# EAGLE design serieAX12 (EAGLE 6.3)
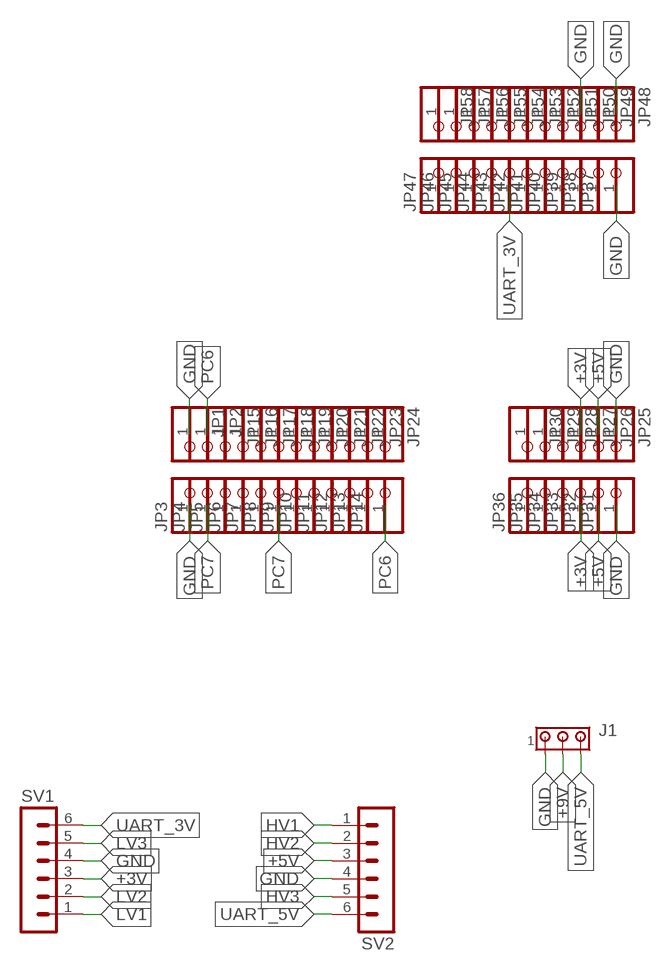
[diagram p0: schematic, sheet 1]

## Parts
J1  MTA03-100  [10X03MTA]
JP1  PINHD-1X1  [1X01]
JP2  PINHD-1X1  [1X01]
JP3  PINHD-1X1  [1X01]
JP4  PINHD-1X1  [1X01]
JP5  PINHD-1X1  [1X01]
JP6  PINHD-1X1  [1X01]
JP7  PINHD-1X1  [1X01]
JP8  PINHD-1X1  [1X01]
JP9  PINHD-1X1  [1X01]
JP10  PINHD-1X1  [1X01]
JP11  PINHD-1X1  [1X01]
JP12  PINHD-1X1  [1X01]
JP13  PINHD-1X1  [1X01]
JP14  PINHD-1X1  [1X01]
JP15  PINHD-1X1  [1X01]
JP16  PINHD-1X1  [1X01]
JP17  PINHD-1X1  [1X01]
JP18  PINHD-1X1  [1X01]
JP19  PINHD-1X1  [1X01]
JP20  PINHD-1X1  [1X01]
JP21  PINHD-1X1  [1X01]
JP22  PINHD-1X1  [1X01]
JP23  PINHD-1X1  [1X01]
JP24  PINHD-1X1  [1X01]
JP25  PINHD-1X1  [1X01]
JP26  PINHD-1X1  [1X01]
JP27  PINHD-1X1  [1X01]
JP28  PINHD-1X1  [1X01]
JP29  PINHD-1X1  [1X01]
JP30  PINHD-1X1  [1X01]
JP31  PINHD-1X1  [1X01]
JP32  PINHD-1X1  [1X01]
JP33  PINHD-1X1  [1X01]
JP34  PINHD-1X1  [1X01]
JP35  PINHD-1X1  [1X01]
JP36  PINHD-1X1  [1X01]
JP37  PINHD-1X1  [1X01]
JP38  PINHD-1X1  [1X01]
JP39  PINHD-1X1  [1X01]
JP40  PINHD-1X1  [1X01]
JP41  PINHD-1X1  [1X01]
JP42  PINHD-1X1  [1X01]
JP43  PINHD-1X1  [1X01]
JP44  PINHD-1X1  [1X01]
JP45  PINHD-1X1  [1X01]
JP46  PINHD-1X1  [1X01]
JP47  PINHD-1X1  [1X01]
JP48  PINHD-1X1  [1X01]
JP49  PINHD-1X1  [1X01]
JP50  PINHD-1X1  [1X01]
JP51  PINHD-1X1  [1X01]
JP52  PINHD-1X1  [1X01]
JP53  PINHD-1X1  [1X01]
JP54  PINHD-1X1  [1X01]
JP55  PINHD-1X1  [1X01]
JP56  PINHD-1X1  [1X01]
JP57  PINHD-1X1  [1X01]
JP58  PINHD-1X1  [1X01]
SV1  MA06-1  [MA06-1]
SV2  MA06-1  [MA06-1]

## Nets
+3V: JP27.1 JP33.1 SV1.3
+5V: JP26.1 JP32.1 SV2.3
+9V: J1.2
GND: J1.1 JP1.1 JP3.1 JP25.1 JP31.1 JP37.1 JP48.1 JP50.1 SV1.4 SV2.4
HV1: SV2.1
HV2: SV2.2
HV3: SV2.5
LV1: SV1.1
LV2: SV1.2
LV3: SV1.5
PC6: JP2.1 JP14.1
PC7: JP4.1 JP8.1
UART_3V: JP43.1 SV1.6
UART_5V: J1.3 SV2.6
Unconnected: JP5.1 JP6.1 JP7.1 JP9.1 JP10.1 JP11.1 JP12.1 JP13.1 JP15.1 JP16.1 JP17.1 JP18.1 JP19.1 JP20.1 JP21.1 JP22.1 JP23.1 JP24.1 JP28.1 JP29.1 JP30.1 JP34.1 JP35.1 JP36.1 JP38.1 JP39.1 JP40.1 JP41.1 JP42.1 JP44.1 JP45.1 JP46.1 JP47.1 JP49.1 JP51.1 JP52.1 JP53.1 JP54.1 JP55.1 JP56.1 JP57.1 JP58.1

## Library data of the parts
J1 = con-amp:MTA03-100: AMP connector
JP1-JP58 = pinhead:PINHD-1X1: PIN HEADER
SV1 SV2 = con-lstb:MA06-1: PIN HEADER; OC_FARNELL: unknown; OC_NEWARK: unknown

## Board
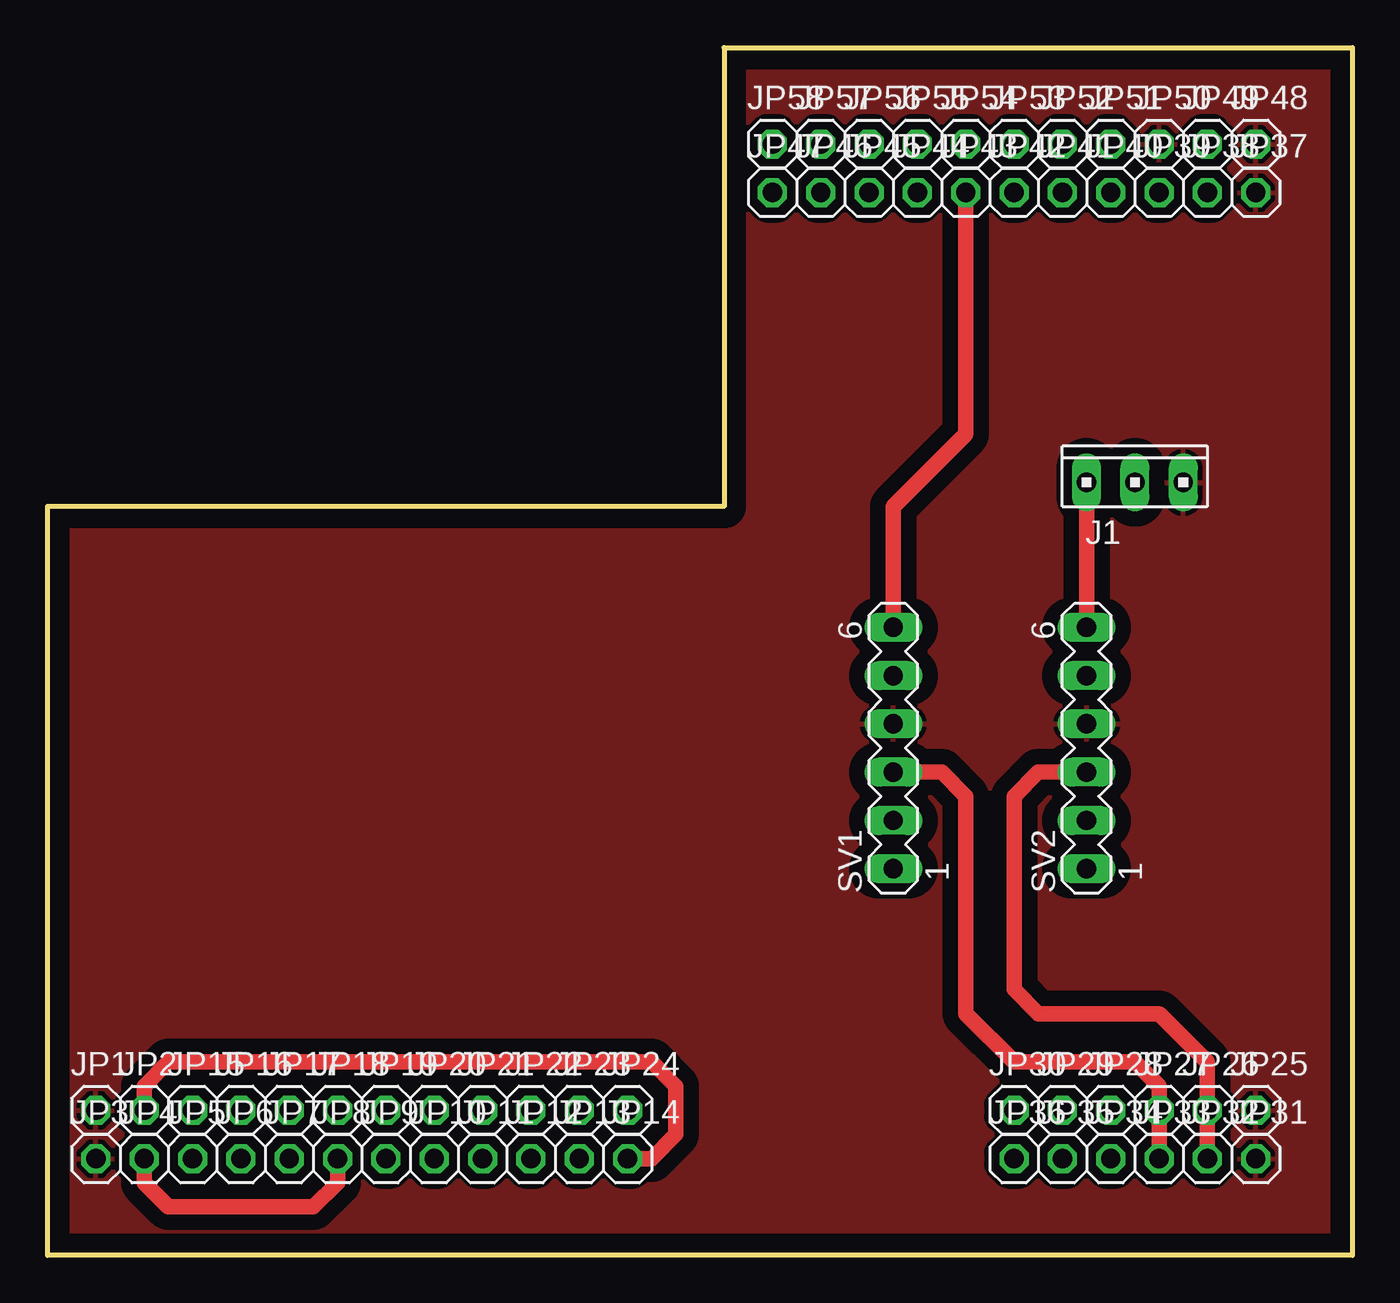
[diagram p1: board, top side]

Size 68.58 x 63.5 mm. Coordinates in mm from the lower left corner, seen from the top.
Outline: 0,0 0,39.37 35.56,39.37 35.56,63.5 68.58,63.5 68.58,0 0,0
Copper layers (1*16): Top 0.035mm / dielectric 1.5mm / Bottom 0.035mm
Design rules "default *": minimum track width 10mil, minimum drill 24mil, track to track 32mil, track to pad 32mil, pad to pad 32mil, via to via 32mil, smd to smd 32mil, copper to edge 40mil, drill to drill 8mil, minimum pad ring 10mil, minimum via ring 8mil, stop-mask expansion 4mil, vias tented up to drill 0mil, thermal gap 10mil

### Footprints (pad centres in the part's own frame; a part is rotated, then mirrored left to right if it is on the bottom)
10X03MTA = drill 1.016 long: 1 2.54,0; 2 0,0; 3 -2.54,0
1X01 = drill 1.016 octagon: 1 0,0
MA06-1 = drill 1.016 long: 1 -6.35,0; 2 -3.81,0; 3 -1.27,0; 4 1.27,0; 5 3.81,0; 6 6.35,0

### Placement (x,y rotation side)
J1  57.15,40.64 0 top
JP1  2.54,7.62 0 top
JP2  5.08,7.62 0 top
JP3  2.54,5.08 0 top
JP4  5.08,5.08 0 top
JP5  7.62,5.08 0 top
JP6  10.16,5.08 0 top
JP7  12.7,5.08 0 top
JP8  15.24,5.08 0 top
JP9  17.78,5.08 0 top
JP10  20.32,5.08 0 top
JP11  22.86,5.08 0 top
JP12  25.4,5.08 0 top
JP13  27.94,5.08 0 top
JP14  30.48,5.08 0 top
JP15  7.62,7.62 0 top
JP16  10.16,7.62 0 top
JP17  12.7,7.62 0 top
JP18  15.24,7.62 0 top
JP19  17.78,7.62 0 top
JP20  20.32,7.62 0 top
JP21  22.86,7.62 0 top
JP22  25.4,7.62 0 top
JP23  27.94,7.62 0 top
JP24  30.48,7.62 0 top
JP25  63.5,7.62 0 top
JP26  60.96,7.62 0 top
JP27  58.42,7.62 0 top
JP28  55.88,7.62 0 top
JP29  53.34,7.62 0 top
JP30  50.8,7.62 0 top
JP31  63.5,5.08 0 top
JP32  60.96,5.08 0 top
JP33  58.42,5.08 0 top
JP34  55.88,5.08 0 top
JP35  53.34,5.08 0 top
JP36  50.8,5.08 0 top
JP37  63.5,55.88 0 top
JP38  60.96,55.88 0 top
JP39  58.42,55.88 0 top
JP40  55.88,55.88 0 top
JP41  53.34,55.88 0 top
JP42  50.8,55.88 0 top
JP43  48.26,55.88 0 top
JP44  45.72,55.88 0 top
JP45  43.18,55.88 0 top
JP46  40.64,55.88 0 top
JP47  38.1,55.88 0 top
JP48  63.5,58.42 0 top
JP49  60.96,58.42 0 top
JP50  58.42,58.42 0 top
JP51  55.88,58.42 0 top
JP52  53.34,58.42 0 top
JP53  50.8,58.42 0 top
JP54  48.26,58.42 0 top
JP55  45.72,58.42 0 top
JP56  43.18,58.42 0 top
JP57  40.64,58.42 0 top
JP58  38.1,58.42 0 top
SV1  44.45,26.67 90 top
SV2  54.61,26.67 90 top

### Tracks (layer width: path | path; a pad name or v marks a point on that pad's centre or on a via)
+3V
  Top 0.813: JP33.1 JP27.1 58.42,8.89 57.15,10.16 50.8,10.16 48.26,12.7 48.26,24.13 46.99,25.4 SV1.3
+5V
  Top 0.813: JP32.1 JP26.1 60.96,10.16 58.42,12.7 52.07,12.7 50.8,13.97 50.8,24.13 52.07,25.4 SV2.3
GND
  pour Top: -5.08,67.31 -5.08,-3.81 74.93,-3.81 74.93,67.31
PC6
  Top 0.813: JP2.1 5.08,8.89 6.35,10.16 31.75,10.16 33.02,8.89 33.02,6.35 31.75,5.08 JP14.1
PC7
  Top 0.813: JP4.1 5.08,3.81 6.35,2.54 13.97,2.54 15.24,3.81 JP8.1
UART_3V
  Top 0.813: JP43.1 48.26,43.18 44.45,39.37 SV1.6
UART_5V
  Top 0.813: J1.3 SV2.6